# EAGLE design NanoBase_L293D_DBL (EAGLE 7.4.0)
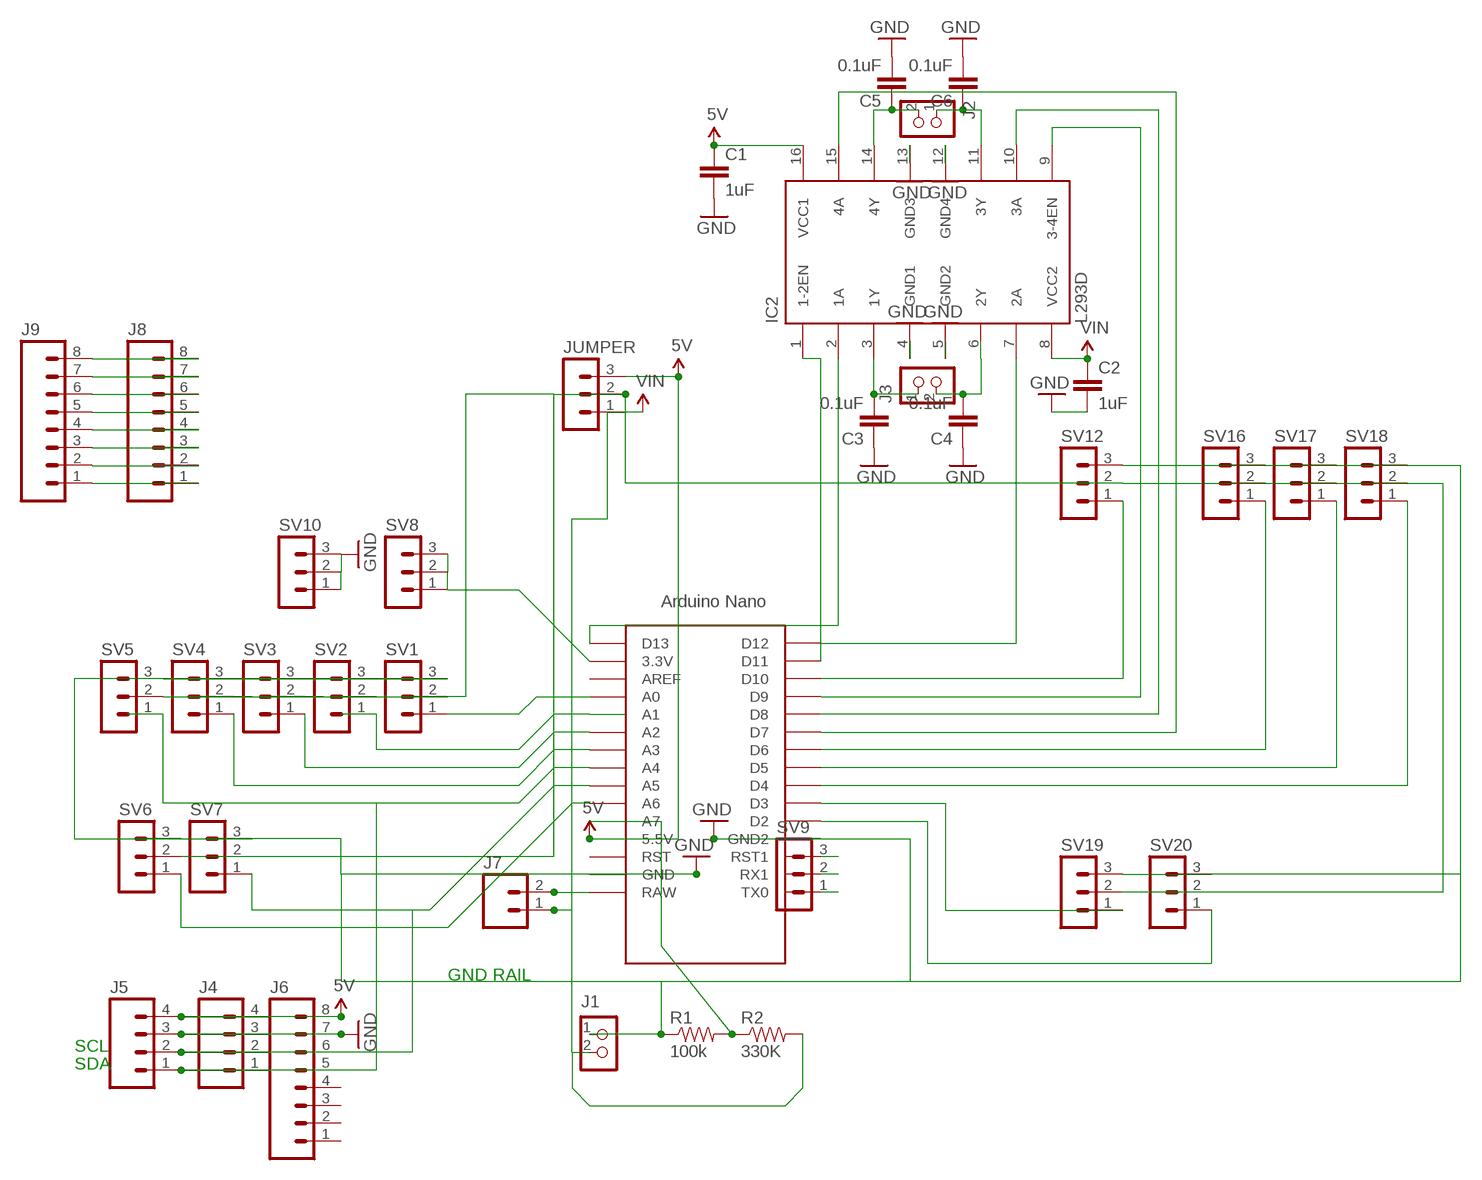
[diagram p0: schematic, sheet 1]

## Parts
C1  1uF  2.2UF-CERCAP-10009  [1206]
C2  1uF  2.2UF-CERCAP-10009  [1206]
C3  0.1uF  2.2UF-CERCAP-10009  [1206]
C4  0.1uF  2.2UF-CERCAP-10009  [1206]
C5  0.1uF  2.2UF-CERCAP-10009  [1206]
C6  0.1uF  2.2UF-CERCAP-10009  [1206]
IC2  L293D  [DIL16]
J1  CON_TERMINAL_BLOCK_02-5MM  [TERMINAL_BLOCK_2P_5]
J2  CON_TERMINAL_BLOCK_02-5MM  [TERMINAL_BLOCK_2P_5]
J3  CON_TERMINAL_BLOCK_02-5MM  [TERMINAL_BLOCK_2P_5]
J4  M04LOCK  [1X04_LOCK]
J5  M04LOCK  [1X04_LOCK]
J6  M08NO_SILK  [1X08_PIN1_NO_SILK]
J7  M02LOCK_LONGPADS  [1X02_LOCK_LONGPADS]
J8  M08NO_SILK  [1X08_PIN1_NO_SILK]
J9  M08NO_SILK  [1X08_PIN1_NO_SILK]
JUMPER  MA03-1  [MA03-1]
R1  100k  RESISTOR1206  [1206]
R2  330K  RESISTOR1206  [1206]
SV1  MA03-1  [MA03-1]
SV2  MA03-1  [MA03-1]
SV3  MA03-1  [MA03-1]
SV4  MA03-1  [MA03-1]
SV5  MA03-1  [MA03-1]
SV6  MA03-1  [MA03-1]
SV7  MA03-1  [MA03-1]
SV8  MA03-1  [MA03-1]
SV9  MA03-1  [MA03-1]
SV10  MA03-1  [MA03-1]
SV12  MA03-1  [MA03-1]
SV16  MA03-1  [MA03-1]
SV17  MA03-1  [MA03-1]
SV18  MA03-1  [MA03-1]
SV19  MA03-1  [MA03-1]
SV20  MA03-1  [MA03-1]
U$1  NANO  [NANO]

## Nets
3.3V: SV8.1 SV8.2 SV8.3 U$1.3.3V
5V: C1.1 IC2.16(VCC1) J4.4 J5.4 J6.8 JUMPER.3 U$1.5V(5.5V)
A0: SV1.1 U$1.A0
A1: SV2.1 U$1.A1
A2: SV3.1 U$1.A2
A3: SV4.1 U$1.A3
A4: J4.1 J5.1 J6.5 SV5.1 U$1.A4
A5: J4.2 J5.2 J6.6 SV7.1 U$1.A5
A6: SV6.1 U$1.A6
A7: R1.2 R2.1 U$1.A7
D2: SV20.1 U$1.D2
D3: SV19.1 U$1.D3
D4: SV18.1 U$1.D4
D5: SV17.1 U$1.D5
D6: SV16.1 U$1.D6
D7-4A: IC2.15(4A) U$1.D7
D8-3A: IC2.10(3A) U$1.D8
D9-3-4EN: IC2.9(3-4EN) U$1.D9
D10: SV12.1 U$1.D10
D11-1-2EN: IC2.1(1-2EN) U$1.D11
D12-2A: IC2.7(2A) U$1.D12
D13-1A: IC2.2(1A) U$1.D13
GND: C1.2 C2.2 C3.1 C4.1 C5.2 C6.2 IC2.4(GND1) IC2.5(GND2) IC2.12(GND4) IC2.13(GND3) J1.1 J4.3 J5.3 J6.7 R1.1 SV1.3 SV2.3 SV3.3 SV4.3 SV5.3 SV6.3 SV7.3 SV10.1 SV10.2 SV10.3 SV12.3 SV16.3 SV17.3 SV18.3 SV19.3 SV20.3 U$1.GND U$1.GND1(GND2)
MIDDLERAIL: JUMPER.2 SV1.2 SV2.2 SV3.2 SV4.2 SV5.2 SV6.2 SV7.2 SV12.2 SV16.2 SV17.2 SV18.2 SV19.2 SV20.2
N$6: SV9.3 U$1.RST1
N$8: J8.1 J9.1
N$10: J8.2 J9.2
N$11: C5.1 IC2.14(4Y) J2.2
N$12: C6.1 IC2.11(3Y) J2.1
N$13: C3.2 IC2.3(1Y) J3.1
N$14: C4.2 IC2.6(2Y) J3.2
N$15: J8.3 J9.3
N$16: J8.4 J9.4
N$18: J8.5 J9.5
N$19: J8.6 J9.6
N$20: J8.7 J9.7
N$21: J8.8 J9.8
RAW: J7.2 U$1.RAW
RX: SV9.2 U$1.RX1
TX: SV9.1 U$1.TX0
VIN: C2.1 IC2.8(VCC2) J1.2 J7.1 JUMPER.1 R2.2
Unconnected: J6.1 J6.2 J6.3 J6.4 U$1.AREF U$1.ICSP1 U$1.ICSP2 U$1.ICSP3 U$1.ICSP4 U$1.ICSP5 U$1.ICSP6 U$1.RST

## Notes on the sheet
- GND RAIL
- SCL
- SDA

## Library data of the parts
C1-C6 = SparkFun-Retired:2.2UF-CER: 2.2uF Ceramic SMT CAP-07888- 10V, 20% (0603) CAP-10009- 50V, 10% (1206); PROD_ID: CAP-10009; VALUE: 2.2uF
IC2 = st-microelectronics:L293D: PUSH-PULL 4 CHANNEL DRIVER; MPN: L293D; OC_FARNELL: 9589619; OC_NEWARK: 56P8249
J1-J3 = dp_devices:CON_TERMINAL_BLOCK_02: 2 poles wire to board terminal block
J4 J5 = SparkFun-Connectors:M04: Header 4 Standard 4-pin 0.1" header. Use with straight break away headers (SKU : PRT-00116), right angle break away headers (PRT-00553), swiss pins (PRT-00743), machine pins (PRT-00117), and female headers (PRT-00115). Molex polarized connector foot print use with SKU : PRT-08231 with associated crimp pins and housings. 1MM SMD Version SKU: PRT-10208; PROD_ID: CONN-09696
J6 J8 J9 = SparkFun-Connectors:M08: Header 8 Standard 8-pin 0.1" header. Use with straight break away headers (SKU : PRT-00116), right angle break away headers (PRT-00553), swiss pins (PRT-00743), machine pins (PRT-00117), and female headers (PRT-00115).
J7 = SparkFun-Connectors:M02: Standard 2-pin 0.1" header. Use with - straight break away headers ( PRT-00116) - right angle break away headers (PRT-00553) - swiss pins (PRT-00743) - machine pins (PRT-00117) - female headers (PRT-00115) Molex polarized connector foot print use with: PRT-08233 with associated crimp pins and housings. 2.54_SCREWTERM for use with PRT-10571. 3.5mm Screw Terminal footprints for PRT-08084 5mm Screw Terminal footprints for use with PRT-08432
JUMPER SV1-SV10 SV12 SV16-SV20 = con-lstb:MA03-1: PIN HEADER; OC_FARNELL: unknown; OC_NEWARK: unknown
R1 R2 = SparkFun-Passives:RESISTOR: Resistor Basic schematic elements and footprints for 0603, 1206, and PTH resistors.
U$1 = Arduino-clone:NANO: Arduino Nano

## Board
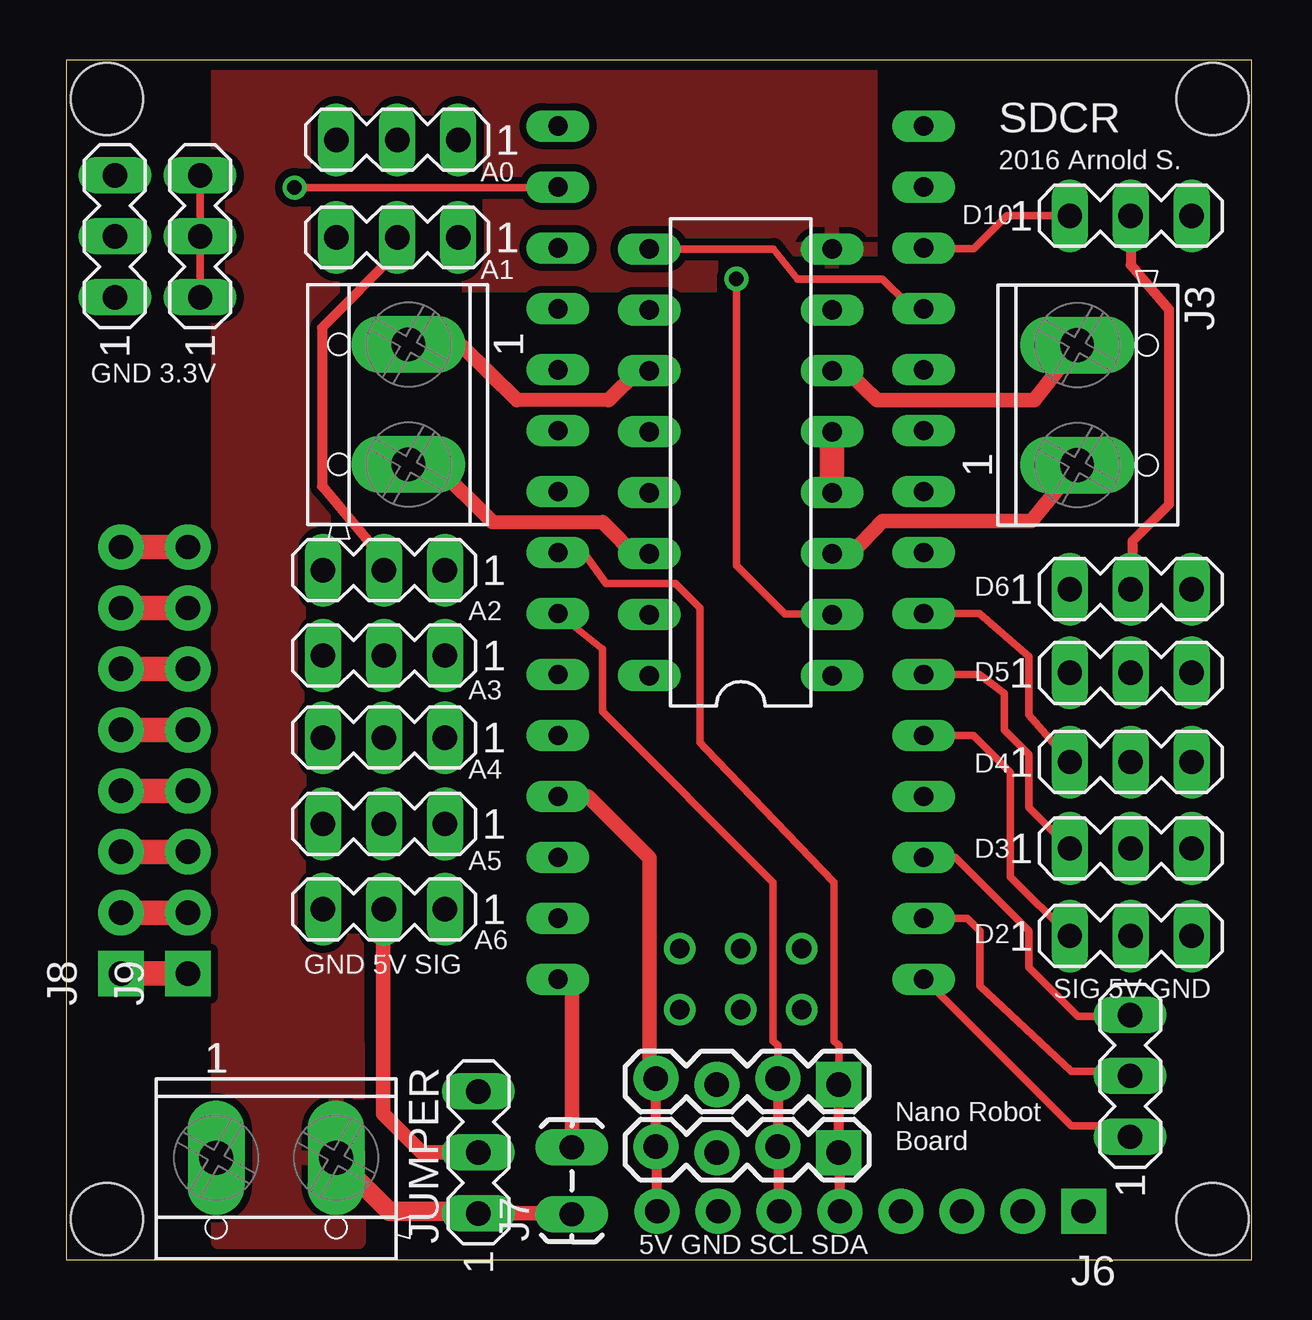
[diagram p1: board, top side]
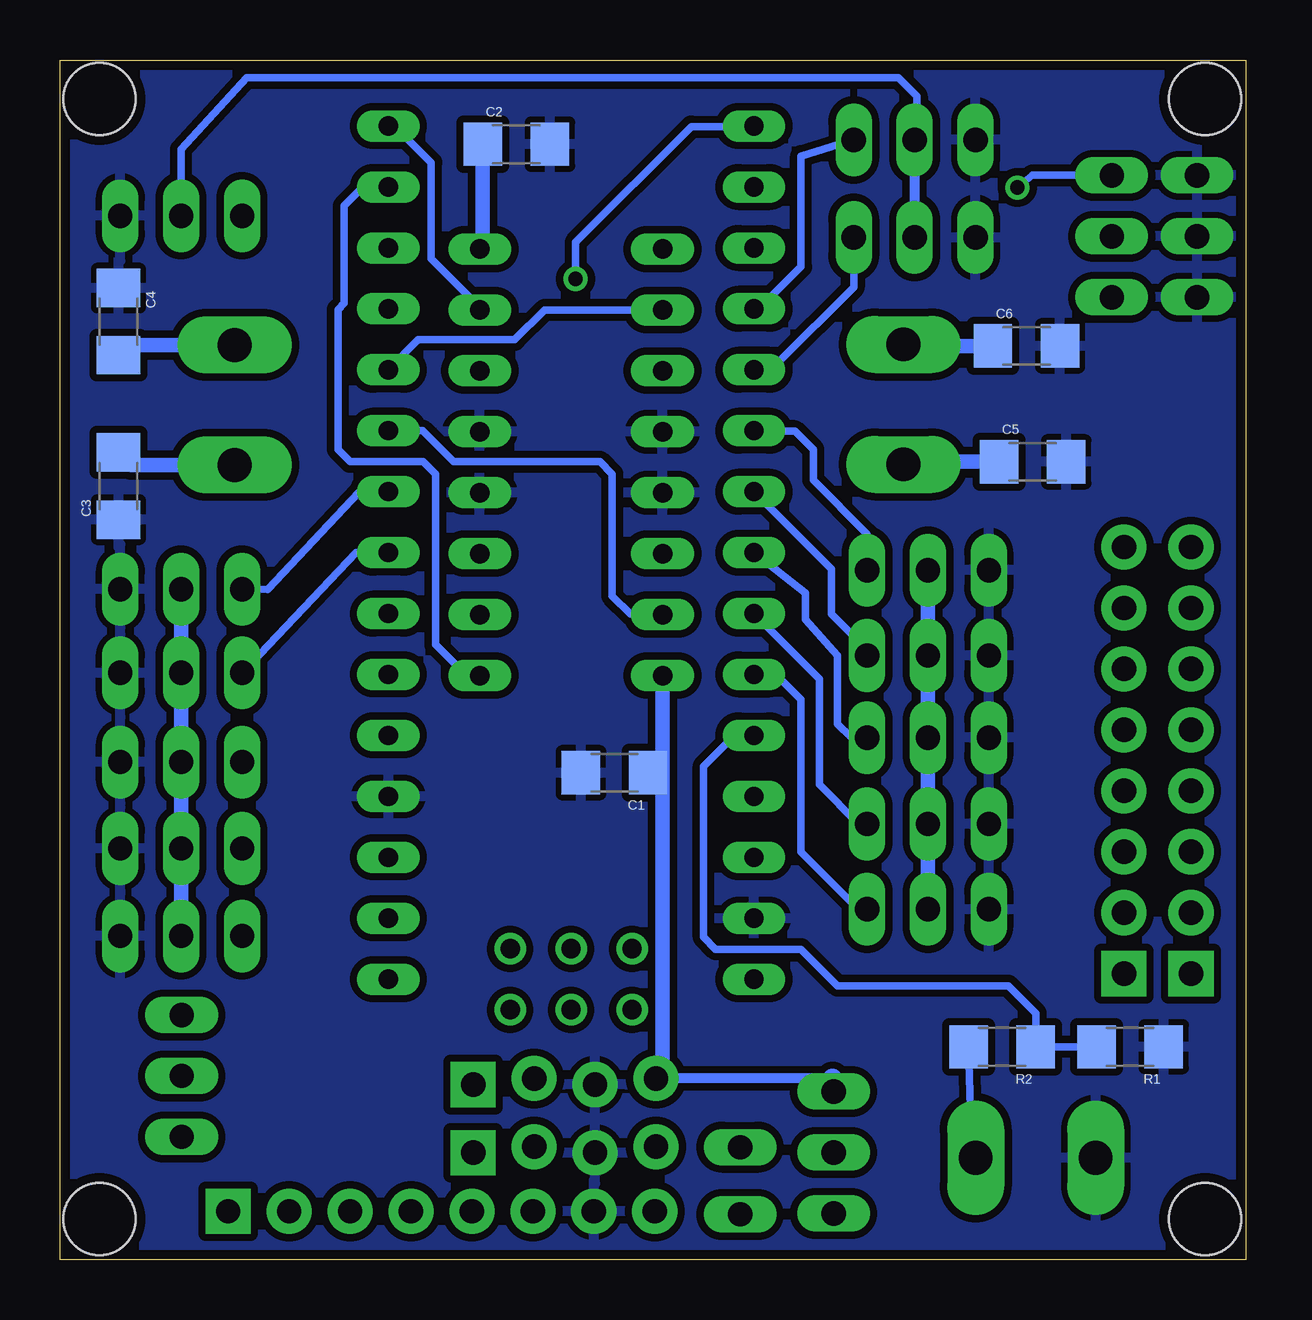
[diagram p2: board, bottom side, seen from below]

Size 49.43 x 50.02 mm. Coordinates in mm from the lower left corner, seen from the top.
Outline: 0,0 49.43,0 49.43,50.02 0,50.02 0,0
Copper layers (1*16): Top 0.035mm / dielectric 1.5mm / Bottom 0.035mm
Design rules "default *": minimum track width 12mil, minimum drill 12mil, track to track 12mil, track to pad 12mil, pad to pad 12mil, via to via 12mil, smd to smd 12mil, copper to edge 16mil, drill to drill 8mil, minimum pad ring 10mil, minimum via ring 8mil, stop-mask expansion 4mil, vias tented up to drill 0mil, thermal gap 10mil
Holes 3 mm at 47.79,1.71 47.79,48.39 1.71,48.39 1.71,1.71

### Footprints (pad centres in the part's own frame; a part is rotated, then mirrored left to right if it is on the bottom)
1206 = smd 1.6 x 1.8: 1 -1.4,0; 2 1.4,0
DIL16 = drill 0.813 long: 1 -8.89,-3.81; 2 -6.35,-3.81; 3 -3.81,-3.81; 4 -1.27,-3.81; 5 1.27,-3.81; 6 3.81,-3.81; 7 6.35,-3.81; 8 8.89,-3.81; 9 8.89,3.81; 10 6.35,3.81; 11 3.81,3.81; 12 1.27,3.81; 13 -1.27,3.81; 14 -3.81,3.81; 15 -6.35,3.81; 16 -8.89,3.81
TERMINAL_BLOCK_2P_5 = drill 1.4 pad 2.38 long: 1 2.5,-0.45; 2 -2.5,-0.45
1X04_LOCK = drill 1.016 pad 1.88 square: 1 0,0.127 | drill 1.016 pad 1.88: 2 2.54,-0.127; 3 5.08,0.127; 4 7.62,-0.127
1X08_PIN1_NO_SILK = drill 1.016 pad 1.88 square: 1 0,0 | drill 1.016 pad 1.88: 2 2.54,0; 3 5.08,0; 4 7.62,0; 5 10.16,0; 6 12.7,0; 7 15.24,0; 8 17.78,0
1X02_LOCK_LONGPADS = drill 1.016 long: 1 -0.127,0; 2 2.667,0
MA03-1 = drill 1.016 long: 1 -2.54,0; 2 0,0; 3 2.54,0
NANO = drill 0.8 long: 3.3V -10.16,24.13; 5V -10.16,-1.27; A0 -10.16,19.05; A1 -10.16,16.51; A2 -10.16,13.97; A3 -10.16,11.43; A4 -10.16,8.89; A5 -10.16,6.35; A6 -10.16,3.81; A7 -10.16,1.27; AREF -10.16,21.59; D2 5.08,1.27; D3 5.08,3.81; D4 5.08,6.35; D5 5.08,8.89; D6 5.08,11.43; D7 5.08,13.97; D8 5.08,16.51; D9 5.08,19.05; D10 5.08,21.59; D11 5.08,24.13; D12 5.08,26.67; D13 -10.16,26.67; GND -10.16,-6.35; GND1 5.08,-1.27; RAW -10.16,-8.89; RST -10.16,-3.81; RST1 5.08,-3.81; RX1 5.08,-6.35; TX0 5.08,-8.89 | drill 0.8: ICSP1 -5.08,-10.16; ICSP2 -5.08,-7.62; ICSP3 -2.54,-10.16; ICSP4 -2.54,-7.62; ICSP5 0,-10.16; ICSP6 0,-7.62

### Placement (x,y rotation side)
C1  26.32,20.31 180 bottom
C2  30.41,46.51 0 bottom
C3  46.99,32.26 90 bottom
C4  46.99,39.12 270 bottom
C5  8.89,33.27 0 bottom
C6  9.14,38.1 0 bottom
IC2  28.12,33.25 90 top
J1  8.76,3.81 180 top
J2  13.82,35.66 90 top
J3  42.6,35.64 270 top
J4  32.21,7.44 180 top
J5  32.21,4.6 180 top
J6  42.42,2.03 180 top
J7  21.08,2.03 90 top
J8  2.29,11.94 90 top
J9  5.08,11.94 90 top
JUMPER  17.19,4.48 90 top
R1  4.83,8.89 180 bottom
R2  10.16,8.89 180 bottom
SV1  13.81,46.69 180 top
SV2  13.81,42.62 180 top
SV3  13.25,28.75 180 top
SV4  13.25,25.2 180 top
SV5  13.25,21.78 180 top
SV6  13.25,14.62 180 top
SV7  13.25,18.18 180 top
SV8  5.59,42.67 90 top
SV9  44.36,7.67 90 top
SV10  2.03,42.67 90 top
SV12  44.38,43.53 0 top
SV16  44.38,27.96 0 top
SV17  44.38,24.48 0 top
SV18  44.38,20.76 0 top
SV19  44.38,17.16 0 top
SV20  44.38,13.51 0 top
U$1  30.66,20.6 0 top

### Tracks (layer width: path | path; a pad name or v marks a point on that pad's centre or on a via)
3.3V  (via drill 0.6)
  Top 0.305: SV8.3 SV8.2 SV8.1 | v9.53,44.7 20.23,44.7 U$1.3.3V
  Bottom 0.305: v9.53,44.7 8.89,45.21 SV8.3
5V
  Top 0.406: J6.8 24.64,4.67 J5.4 J4.4
  Top 0.61: 20.52,19.3 U$1.5V 21.75,19.33 24.31,16.76 24.31,7.84 J4.4
  Bottom 0.406: 17.22,7.57 J4.4 | C1.1 24.58,20.31 24.31,20.57
  Bottom 0.61: IC2.16 24.31,20.57 24.31,7.84 J4.4
  Bottom 0.813: 17.22,7.57 JUMPER.3
A0
  Bottom 0.305: U$1.A0 20.3,39.65 18.54,41.4 18.54,46.02 SV1.1
A1
  Bottom 0.305: SV2.1 16.35,40.55 19.56,37.34 20.27,37.34 U$1.A1
A2
  Bottom 0.305: SV3.1 15.79,30.27 18.03,32.51 18.03,33.78 18.8,34.54 20.48,34.54 U$1.A2
A3
  Bottom 0.305: SV4.1 15.79,25.44 17.27,26.92 17.27,28.8 U$1.A3
A4
  Top 0.305: J4.1 32.21,8.94 32,9.14 32,15.75 26.66,21.32 26.42,21.57 26.42,27.18 25.4,28.19 22.5,28.19 21.59,29.46 20.52,29.46 U$1.A4
  Top 0.406: J6.5 32.26,4.42 J5.1 J4.1
  Bottom 0.305: SV5.1 16.44,21.78 17.02,22.35 17.02,25.2 18.36,26.7 18.36,27.8 U$1.A4
A5
  Top 0.305: J4.2 29.67,8.94 29.46,9.14 29.46,15.75 22.35,22.86 22.35,25.48 U$1.A5
  Top 0.406: J4.2 J5.2 29.72,4.67 J6.6
  Bottom 0.305: SV7.1 16.14,18.18 17.78,19.81 17.78,24.22 U$1.A5
A6
  Bottom 0.305: SV6.1 16.14,14.62 18.54,17.02 18.54,23.37 19.56,24.38 20.48,24.38 U$1.A6
A7
  Bottom 0.305: R1.2 R2.1 8.76,10.28 9.91,11.43 17.02,11.43 18.54,12.95 22.1,12.95 22.61,13.46 22.61,20.57 21.34,21.84 20.52,21.84 U$1.A7
D2
  Top 0.305: U$1.D2 37.82,21.87 39.37,20.32 39.37,15.98 SV20.1
D3
  Top 0.305: U$1.D3 38.08,24.41 39.12,23.62 39.12,22.1 40.13,21.08 40.13,18.86 SV19.1
D4
  Top 0.305: U$1.D4 38.08,26.95 40.13,25.15 40.13,22.72 SV18.1
D5
  Bottom 0.305: U$1.D5 37.08,29.49 SV17.1
D6
  Bottom 0.305: U$1.D6 36.96,32 40.77,27.94 SV16.1
D7-4A
  Bottom 0.305: U$1.D7 34.31,34.57 33.02,33.27 26.92,33.27 26.42,32.77 26.42,27.69 25.65,26.92 24.33,26.92 IC2.15
D8-3A
  Bottom 0.305: IC2.10 29.23,39.6 30.48,38.35 34.49,38.35 U$1.D8
D9-3-4EN
  Top 0.305: IC2.9 29.49,42.14 30.48,40.89 34.04,40.89 35.05,39.88 35.51,39.88 U$1.D9
D10
  Top 0.305: SV12.1 39.21,43.53 37.85,42.16 35.76,42.16 U$1.D10
D11-1-2EN
  Bottom 0.305: IC2.1 32.49,24.36 33.78,25.65 33.78,32.77 34.29,33.27 37.34,33.27 37.85,33.78 37.85,39.62 37.59,39.88 37.59,43.94 36.83,44.7 35.76,44.7 U$1.D11
D12-2A
  Bottom 0.305: U$1.D12 35.45,47.25 33.95,45.75 33.95,41.75 31.95,39.75 IC2.7
D13-1A  (via drill 0.6)
  Top 0.305: v27.94,40.89 27.94,28.96 29.97,26.92 31.91,26.92 IC2.2
  Bottom 0.305: U$1.D13 20.52,47.24 23.11,47.24 27.94,42.42 v27.94,40.89
GND
  Top 1.016: IC2.4 31.93,34.47 32,34.54
  pour Bottom: 1.2,49.5 49.2,49.5 49.2,0.3 0.6,0.3 0.6,49.5
MIDDLERAIL
  Top 0.305: 13.2,28.49 SV3.2
  Top 0.406: SV2.2 13.81,42 10.67,38.86 10.67,32.26 13.21,29.21 13.21,28.54 SV3.2 | SV12.2 44.38,41.47 45.97,39.62 45.97,31.5 44.45,29.97 44.45,28.03 SV16.2
  Top 0.61: JUMPER.2 14.82,4.48 13.21,6.1 13.21,14.58 SV6.2
  Bottom 0.305: SV12.2 44.38,46.3 41.66,49.28 14.48,49.28 13.72,48.51 13.72,46.27 SV1.2
  Bottom 0.406: SV1.2 SV2.2
  Bottom 0.61: SV16.2 SV17.2 SV18.2 SV19.2 SV20.2 | SV3.2 SV4.2 SV5.2 SV7.2 SV6.2
N$6
  Top 0.305: U$1.RST1 37.06,16.79 40.13,13.72 40.13,12.19 42.16,10.16 44.3,10.16 SV9.3
N$8
  Top 1.016: J8.1 J9.1
N$10
  Top 1.016: J8.2 J9.2
N$11
  Top 0.584: 17.78,30.76 22.35,30.76
  Top 0.61: J2.2 15.35,33.16 17.78,30.76 | 22.35,30.76 23.88,29.21 24.08,29.21 IC2.14
  Bottom 0.61: C5.1 14.16,33.27 J2.2
N$12
  Top 0.584: 22.61,35.84 18.8,35.84
  Top 0.61: IC2.11 23.85,37.06 22.61,35.84 | 18.8,35.84 16.51,38.1 14.33,38.1 J2.1
  Bottom 0.61: C6.1 14.21,38.1 J2.1
N$13
  Top 0.61: IC2.3 32.74,29.44 34.04,30.81 40.23,30.81 J3.1
  Bottom 0.61: J3.1 46.47,33.14 C3.2
N$14
  Top 0.61: IC2.6 32.53,37.06 33.81,35.84 40.36,35.84 J3.2
  Bottom 0.61: J3.2 46.57,38.14 C4.2
N$15
  Top 1.016: J8.3 J9.3
N$16
  Top 1.016: J8.4 J9.4
N$18
  Top 1.016: J8.5 J9.5
N$19
  Top 1.016: J8.6 J9.6
N$20
  Top 1.016: J8.7 J9.7
N$21
  Top 1.016: J8.8 J9.8
RAW
  Top 0.61: J7.2 21.08,11.38 U$1.RAW
RX
  Top 0.305: U$1.RX1 37.57,14.25 38.1,13.72 38.1,11.43 41.91,7.87 44.16,7.87 SV9.2
TX
  Top 0.305: U$1.TX0 35.79,11.71 41.91,5.59 43.9,5.59 SV9.1
VIN
  Top 0.305: 11.56,3.94 11.43,3.81 J1.2
  Top 0.61: JUMPER.1 20.79,1.94 J7.1
  Top 0.813: 11.26,4.24 11.56,3.94 13.46,2.03 16.59,2.03 JUMPER.1
  Bottom 0.305: R2.2 11.43,4.43 J1.2
  Bottom 0.61: C2.1 31.81,42.27 IC2.8
  pour Top: 6.35,50.04 33.53,49.78 33.53,40.64 11.94,40.64 12.19,0.76 6.35,0.76

### Text on the board
tNames: SDCR | A0 | 2016 Arnold S. | D10 | A1 | GND 3.3V | D6 | A2 | D5 | A3 | A4 | D4 | D3 | A5 | A6 | D2 | GND 5V SIG | SIG 5V GND | Nano Robot / Board | 5V GND SCL SDA